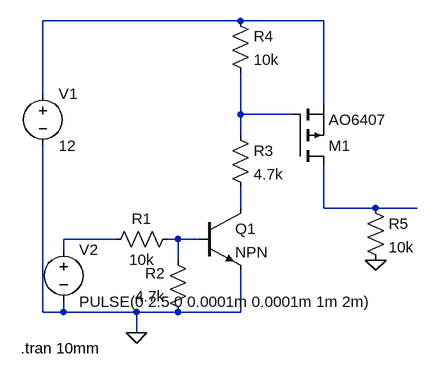
[diagram p0: schematic Draft1.asc]
Draft1.asc, the LTspice schematic file:
Version 4
SHEET 1 880 680
WIRE 16 32 -288 32
WIRE 144 32 16 32
WIRE -288 144 -288 32
WIRE 144 160 144 32
WIRE 16 176 16 112
WIRE 96 176 16 176
WIRE 16 208 16 176
WIRE 16 320 16 288
WIRE 144 320 144 256
WIRE 224 320 144 320
WIRE 288 320 224 320
WIRE -176 368 -256 368
WIRE -80 368 -96 368
WIRE -48 368 -80 368
WIRE -256 384 -256 368
WIRE -80 400 -80 368
WIRE -288 480 -288 224
WIRE -256 480 -256 464
WIRE -256 480 -288 480
WIRE -144 480 -256 480
WIRE -80 480 -144 480
WIRE 16 480 16 416
WIRE 16 480 -80 480
WIRE -144 512 -144 480
FLAG -144 512 0
FLAG 224 400 0
SYMBOL pmos 96 256 M180
SYMATTR InstName M1
SYMATTR Value AO6407
SYMBOL npn -48 320 R0
SYMATTR InstName Q1
SYMBOL voltage -288 128 R0
WINDOW 123 0 0 Left 0
WINDOW 39 0 0 Left 0
SYMATTR InstName V1
SYMATTR Value 12
SYMBOL res -80 352 R90
WINDOW 0 0 56 VBottom 2
WINDOW 3 32 56 VTop 2
SYMATTR InstName R1
SYMATTR Value 10k
SYMBOL res -64 496 R180
WINDOW 0 36 76 Left 2
WINDOW 3 36 40 Left 2
SYMATTR InstName R2
SYMATTR Value 4.7k
SYMBOL voltage -256 368 R0
WINDOW 123 0 0 Left 0
WINDOW 39 0 0 Left 0
SYMATTR InstName V2
SYMATTR Value PULSE(0 2.5 0 0.0001m 0.0001m 1m 2m)
SYMBOL res 0 192 R0
SYMATTR InstName R3
SYMATTR Value 4.7k
SYMBOL res 0 16 R0
SYMATTR InstName R4
SYMATTR Value 10k
SYMBOL res 208 304 R0
SYMATTR InstName R5
SYMATTR Value 10k
TEXT -322 536 Left 2 !.tran 10mm

The netlist it stands for:
* Draft1.asc
M1 N004 N002 N001 N001 AO6407
Q1 N003 N006 0 0 NPN
V1 N001 0 12
R1 N006 N005 10k
R2 0 N006 4.7k
V2 N005 0 PULSE(0 2.5 0 0.0001m 0.0001m 1m 2m)
R3 N002 N003 4.7k
R4 N001 N002 10k
R5 N004 0 10k
.model NPN NPN
.model PNP PNP
.lib standard.bjt
.model NMOS NMOS
.model PMOS PMOS
.lib standard.mos
.tran 10mm
.backanno
.end